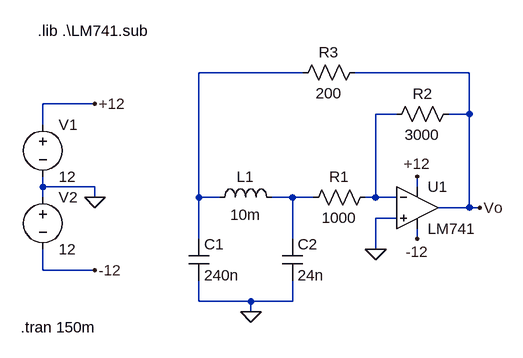
[diagram p0: schematic ProvaInduttori.asc]
ProvaInduttori.asc, the LTspice schematic file:
Version 4
SHEET 1 880 680
WIRE 352 -32 192 -32
WIRE 608 -32 432 -32
WIRE 32 16 -48 16
WIRE 496 32 464 32
WIRE 608 32 608 -32
WIRE 608 32 576 32
WIRE -48 48 -48 16
WIRE -48 144 -48 128
WIRE 32 144 -48 144
WIRE 528 144 528 128
WIRE -48 160 -48 144
WIRE 32 160 32 144
WIRE 192 160 192 -32
WIRE 224 160 192 160
WIRE 336 160 304 160
WIRE 368 160 336 160
WIRE 464 160 464 32
WIRE 464 160 448 160
WIRE 496 160 464 160
WIRE 608 176 608 32
WIRE 608 176 560 176
WIRE 624 176 608 176
WIRE 496 192 464 192
WIRE 192 224 192 160
WIRE 336 224 336 160
WIRE 528 224 528 208
WIRE 464 240 464 192
WIRE -48 272 -48 240
WIRE 32 272 -48 272
WIRE 192 320 192 288
WIRE 272 320 192 320
WIRE 336 320 336 288
WIRE 336 320 272 320
WIRE 272 336 272 320
FLAG 32 160 0
FLAG 32 16 +12
FLAG 32 272 -12
FLAG 528 128 +12
FLAG 528 224 -12
FLAG 464 240 0
FLAG 272 336 0
FLAG 624 176 Vo
SYMBOL voltage -48 32 R0
SYMATTR InstName V1
SYMATTR Value 12
SYMBOL voltage -48 144 R0
SYMATTR InstName V2
SYMATTR Value 12
SYMBOL res 464 144 R90
WINDOW 0 0 56 VBottom 2
WINDOW 3 32 56 VTop 2
SYMATTR InstName R1
SYMATTR Value 1000
SYMBOL res 592 16 R90
WINDOW 0 0 56 VBottom 2
WINDOW 3 32 56 VTop 2
SYMATTR InstName R2
SYMATTR Value 3000
SYMBOL res 448 -48 R90
WINDOW 0 0 56 VBottom 2
WINDOW 3 32 56 VTop 2
SYMATTR InstName R3
SYMATTR Value 200
SYMBOL ind 208 176 R270
WINDOW 0 32 56 VTop 2
WINDOW 3 5 56 VBottom 2
SYMATTR InstName L1
SYMATTR Value 10m
SYMBOL cap 176 224 R0
SYMATTR InstName C1
SYMATTR Value 240n
SYMBOL cap 320 224 R0
SYMATTR InstName C2
SYMATTR Value 24n
SYMBOL Opamps\\opamp2 528 112 R0
SYMATTR InstName U1
SYMATTR Value LM741
TEXT -82 360 Left 2 !.tran 150m
TEXT -56 -96 Left 2 !.lib .\\LM741.sub

The netlist it stands for:
* ProvaInduttori.asc
V1 +12 0 12
V2 0 -12 12
R1 N002 N003 1000
R2 Vo N002 3000
R3 Vo N001 200
L1 N001 N003 10m
C1 N001 0 240n
C2 N003 0 24n
XU1 0 N002 +12 -12 Vo LM741  ; pins In+ In- V+ V- OUT
.tran 150m
.lib .\LM741.sub
.backanno
.end